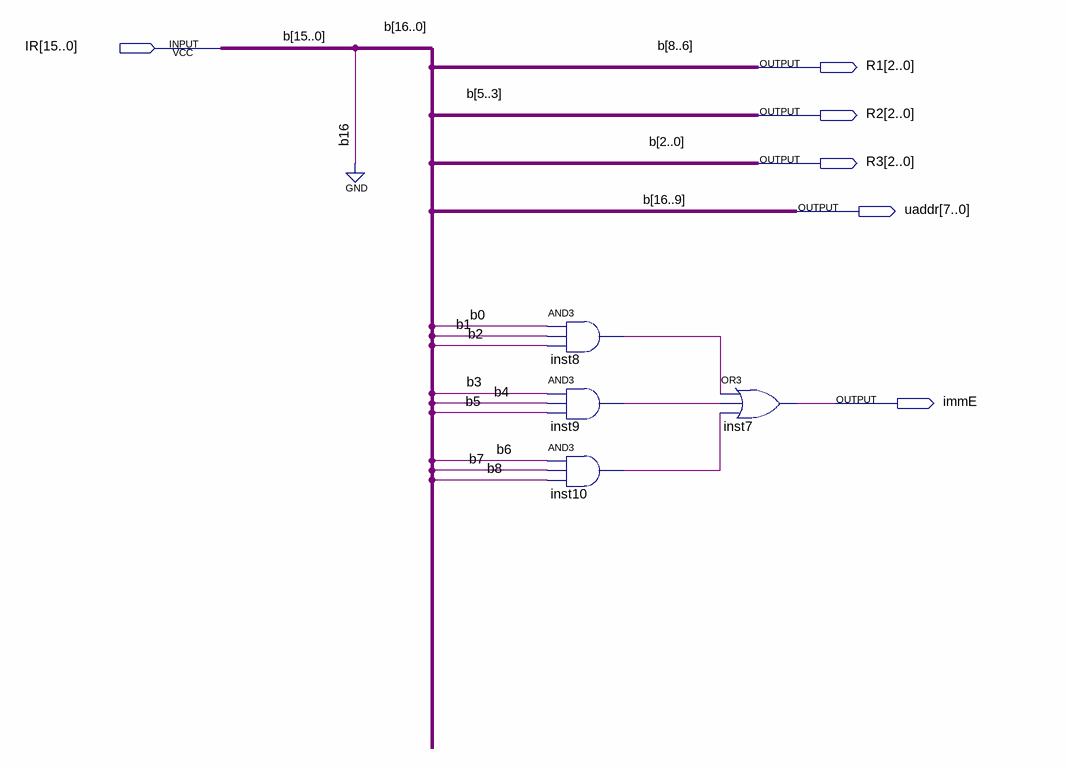
[diagram p0: schematic sheet]
// Quartus schematic DECODER.bdf as structural Verilog: 4 symbols, 6 pins
module DECODER (
  input  [15:0] IR,
  output [2:0] R1,
  output [2:0] R2,
  output [2:0] R3,
  output [7:0] uaddr,
  output immE
);

  wire inst8_out, inst9_out, inst10_out;

  and inst8 (inst8_out, IR[0], IR[1], IR[2]);
  and inst9 (inst9_out, IR[3], IR[4], IR[5]);
  and inst10 (inst10_out, IR[6], IR[7], IR[8]);
  or inst7 (immE, inst8_out, inst9_out, inst10_out);

  assign R1 = IR[8:6];
  assign R2 = IR[5:3];
  assign R3 = IR[2:0];
  assign uaddr = {1'b0, IR[15:9]};

  // Other names for the same wires on the sheet: b[15:0] = IR; b0 = IR[0]; b1 = IR[1]; b2 = IR[2]; b3 = IR[3];
  //   b4 = IR[4]; b5 = IR[5]; b6 = IR[6]; b7 = IR[7]; b8 = IR[8]
endmodule
